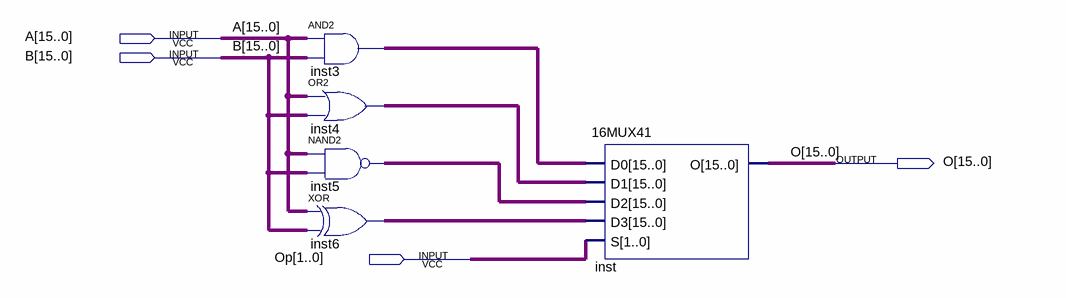
[diagram p0: schematic sheet]
// Quartus schematic LU.bdf as structural Verilog: 5 symbols, 4 pins
module LU (
  input  [15:0] A,
  input  [15:0] B,
  input  [1:0] Op,
  output [15:0] O
);

  wire [15:0] inst3_out, inst4_out, inst5_out, inst6_out;

  assign inst3_out = A & B;  // AND2 inst3, 16 bits wide
  assign inst4_out = A | B;  // OR2 inst4, 16 bits wide
  assign inst5_out = ~(A & B);  // NAND2 inst5, 16 bits wide
  assign inst6_out = A ^ B;  // XOR inst6, 16 bits wide
  \16MUX41  inst (.D0(inst3_out), .D1(inst4_out), .D2(inst5_out), .D3(inst6_out), .S(Op), .O(O));
endmodule
